# EAGLE design new (EAGLE 9.6.2)
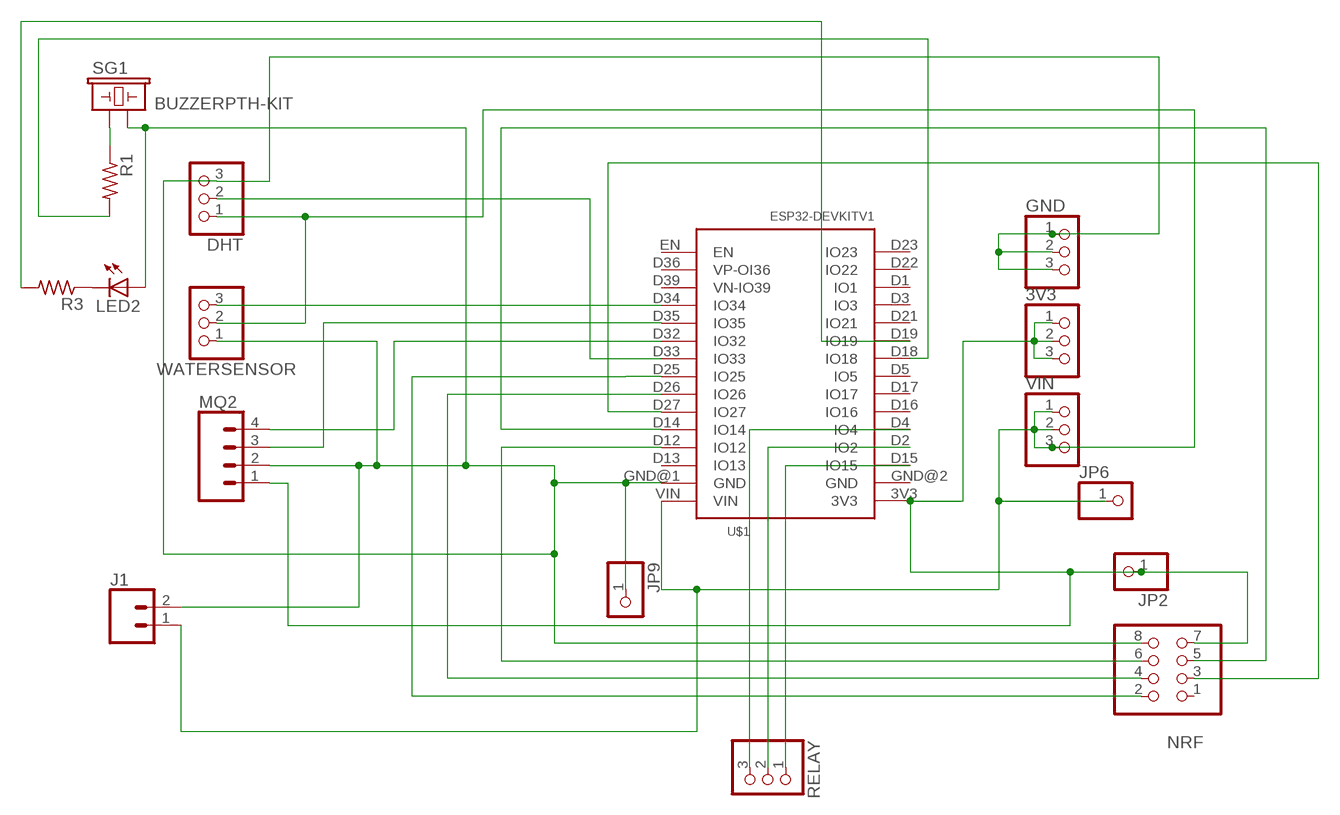
[diagram p0: schematic, sheet 1]

## Parts
3V3  PINHD-1X3  [1X03]
DHT  PINHD-1X3  [1X03]
GND  PINHD-1X3  [1X03]
J1  CONN_02  [1X02]
JP2  PINHD-1X1  [1X01]
JP6  PINHD-1X1  [1X01]
JP9  PINHD-1X1  [1X01]
LED2  LED5MM  [LED5MM]
MQ2  CONN_04PTH  [1X04]
NRF  PINHD-2X4  [2X04]
R1  R-US_0207/7  [0207/7]
R3  R-US_0207/7  [0207/7]
RELAY  PINHD-1X3  [1X03]
SG1  BUZZERPTH-KIT  [BUZZER-12MM-KIT]
U$1  ESP32DEVKITV1  [ESP32-DEVKITV1]
VIN  PINHD-1X3  [1X03]
WATERSENSOR  PINHD-1X3  [1X03]

## Nets
N$1: R1.1 SG1.+
N$2: R1.2 U$1.D18(IO18)
N$3: NRF.4 U$1.D26(IO26)
N$4: NRF.2 U$1.D25(IO25)
N$5: DHT.3 GND.1 GND.2 GND.3 J1.2 JP9.1 LED2.A MQ2.2 NRF.8 SG1.- U$1.GND@1(GND) WATERSENSOR.1
N$6: R3.2 U$1.D19(IO19)
N$7: NRF.3 U$1.D27(IO27)
N$8: LED2.K(C) R3.1
N$9: NRF.6 U$1.D12(IO12)
N$10: NRF.5 U$1.D14(IO14)
N$11: DHT.2 U$1.D33(IO33)
N$12: DHT.1 J1.1 JP6.1 U$1.VIN VIN.1 VIN.2 VIN.3 WATERSENSOR.2
N$13: U$1.D34(IO34) WATERSENSOR.3
N$14: RELAY.3 U$1.D4(IO4)
N$15: RELAY.2 U$1.D2(IO2)
N$16: MQ2.4 U$1.D32(IO32)
N$17: MQ2.3 U$1.D35(IO35)
N$18: RELAY.1 U$1.D15(IO15)
N$19: 3V3.1 3V3.2 3V3.3 JP2.1 MQ2.1 NRF.7 U$1.3V3
Unconnected: NRF.1 U$1.D1(IO1) U$1.D3(IO3) U$1.D5(IO5) U$1.D13(IO13) U$1.D16(IO16) U$1.D17(IO17) U$1.D21(IO21) U$1.D22(IO22) U$1.D23(IO23) U$1.D36(VP-OI36) U$1.D39(VN-IO39) U$1.EN U$1.GND@2(GND)

## Library data of the parts
3V3 DHT GND RELAY VIN WATERSENSOR = adafruit:PINHD-1X3: PIN HEADER
J1 = SparkFun-Connectors:CONN_02: Multi connection point. Often used as Generic Header-pin footprint for 0.1 inch spaced/style header connections On any of the 0.1 inch spaced packages, you can populate with these: Break Away Headers - Straight <https://www.sparkfun.com/products/116> (PRT-00116) Break Away Male Headers - Right Angle <https://www.sparkfun.com/products/553> (PRT-00553) Female Headers <https://www.sparkfun.com/products/115> (PRT-00115) Break Away Headers - Machine Pin <https://www.sparkfun.com/products/117> (PRT-00117) Break Away Female Headers - Swiss Machine Pin <https://www.sparkfun.com/products/743> (PRT-00743) For SCREWTERMINALS and SPRING TERMINALS visit here: Screw Terimnals on SparkFun.com <https://www.sparkfun.com/search/results?term=Screw+Terminals> (5mm/3.5mm/2.54mm spacing) This device is also useful as a general connection point to wire up your design to another part of your project. Our various solder wires solder well into these plated through hole pads. Hook-Up Wire - Assortment (Stranded, 22 AWG) <https://www.sparkfun.com/products/11375> (PRT-11375) Hook-Up Wire - Assortment (Solid Core, 22 AWG) <https://www.sparkfun.com/products/11367> (PRT-11367) View the entire wire category on our website here <https://www.sparkfun.com/categories/141> Special notes: Molex polarized connector foot print use with: PRT-08233 with associated crimp pins and housings. 2.54_SCREWTERM for use with PRT-10571. 3.5mm Screw Terminal footprints for PRT-08084 5mm Screw Terminal footprints for use with PRT-08432
JP2 JP6 JP9 = adafruit:PINHD-1X1: Pin header 1x1 for 0.1" spacing With round pins
LED2 = adafruit:LED: LED OSRAM: - CHIPLED LG R971, LG N971, LY N971, LG Q971, LY Q971, LO R971, LY R971 LH N974, LH R974 LS Q976, LO Q976, LY Q976 LO Q996 - Hyper CHIPLED LW Q18S LB Q993, LB Q99A, LB R99A - SideLED LS A670, LO A670, LY A670, LG A670, LP A670 LB A673, LV A673, LT A673, LW A673 LH A674 LY A675 LS A676, LA A676, LO A676, LY A676, LW A676 LS A679, LY A679, LG A679 - Hyper Micro SIDELED® LS Y876, LA Y876, LO Y876, LY Y876 LT Y87S - SmartLED LW L88C, LW L88S LB L89C, LB L89S, LG L890 LS L89K, LO L89K, LY L89K LS L896, LA L896, LO L896, LY L896 - TOPLED LS T670, LO T670, LY T670, LG T670, LP T670 LSG T670, LSP T670, LSY T670, LOP T670, LYG T670 LG T671, LOG T671, LSG T671 LB T673, LV T673, LT T673, LW T673 LH T674 LS T676, LA T676, LO T676, LY T676, LB T676, LH T676, LSB T676, LW T676 LB T67C, LV T67C, LT T67C, LS T67K, LO T67K, LY T67K, LW E67C LS E67B, LA E67B, LO E67B, LY E67B, LB E67C, LV E67C, LT E67C LW T67C LS T679, LY T679, LG T679 LS T770, LO T770, LY T770, LG T770, LP T770 LB T773, LV T773, LT T773, LW T773 LH T774 LS E675, LA E675, LY E675, LS T675 LS T776, LA T776, LO T776, LY T776, LB T776 LHGB T686 LT T68C, LB T68C - Hyper Mini TOPLED® LB M676 - Mini TOPLED Santana® LG M470 LS M47K, LO M47K, LY M47K Source: http://www.osram.convergy.de/
MQ2 = SparkFun-Connectors:CONN_04: Multi connection point. Often used as Generic Header-pin footprint for 0.1 inch spaced/style header connections On any of the 0.1 inch spaced packages, you can populate with these: Break Away Headers - Straight <https://www.sparkfun.com/products/116> (PRT-00116) Break Away Male Headers - Right Angle <https://www.sparkfun.com/products/553> (PRT-00553) Female Headers <https://www.sparkfun.com/products/115> (PRT-00115) Break Away Headers - Machine Pin <https://www.sparkfun.com/products/117> (PRT-00117) Break Away Female Headers - Swiss Machine Pin <https://www.sparkfun.com/products/743> (PRT-00743) For SCREWTERMINALS and SPRING TERMINALS visit here: Screw Terimnals on SparkFun.com <https://www.sparkfun.com/search/results?term=Screw+Terminals> (5mm/3.5mm/2.54mm spacing) This device is also useful as a general connection point to wire up your design to another part of your project. Our various solder wires solder well into these plated through hole pads. Hook-Up Wire - Assortment (Stranded, 22 AWG) <https://www.sparkfun.com/products/11375> (PRT-11375) Hook-Up Wire - Assortment (Solid Core, 22 AWG) <https://www.sparkfun.com/products/11367> (PRT-11367) View the entire wire category on our website here <https://www.sparkfun.com/categories/141> Special notes: Molex polarized connector foot print use with SKU : PRT-08231 with associated crimp pins and housings. 1MM SMD Version SKU: PRT-10208; PROD_ID: CONN-09696
NRF = adafruit:PINHD-2X4: PIN HEADER
R1 R3 = adafruit:R-US_: RESISTOR, American symbol
SG1 = jonnew:BUZZER: Buzzer 12mm Spark Fun Electronics SKU : Comp-Buzzer; PROD_ID: COMP-08253
U$1 = ESP32-DEVKITV1 (1):ESP32DEVKITV1

## Board
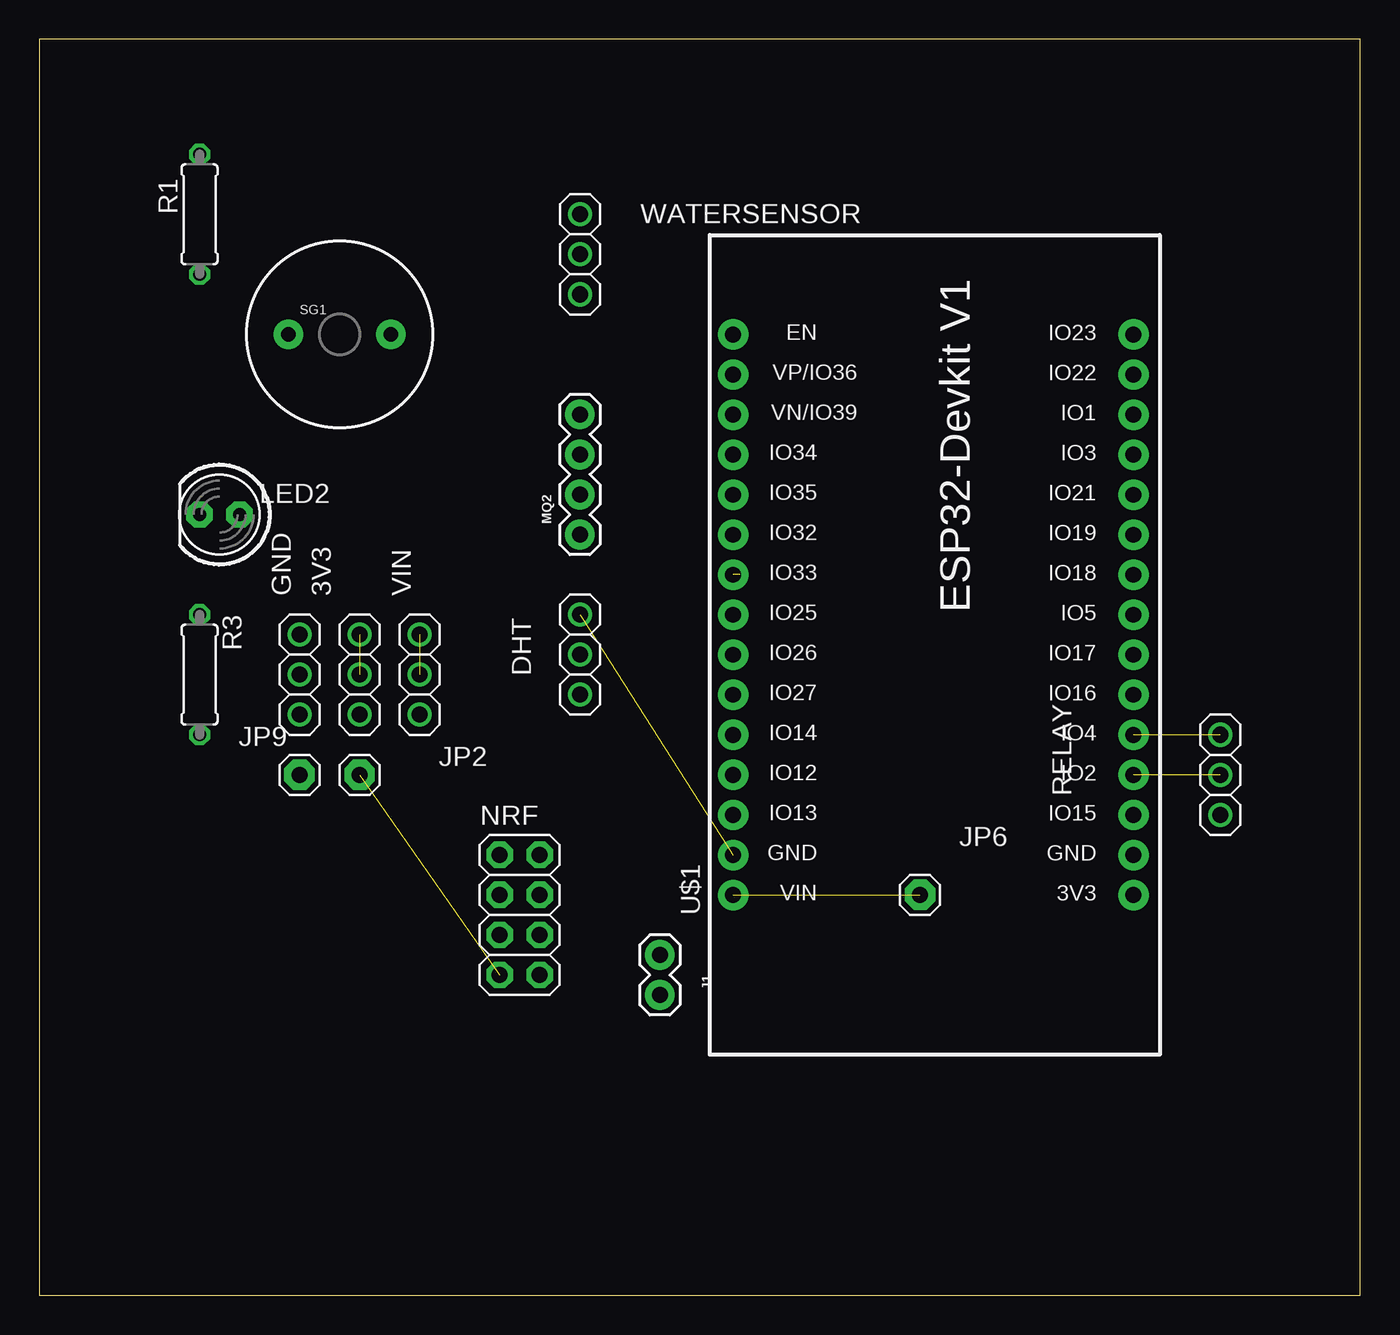
[diagram p1: board, top side]
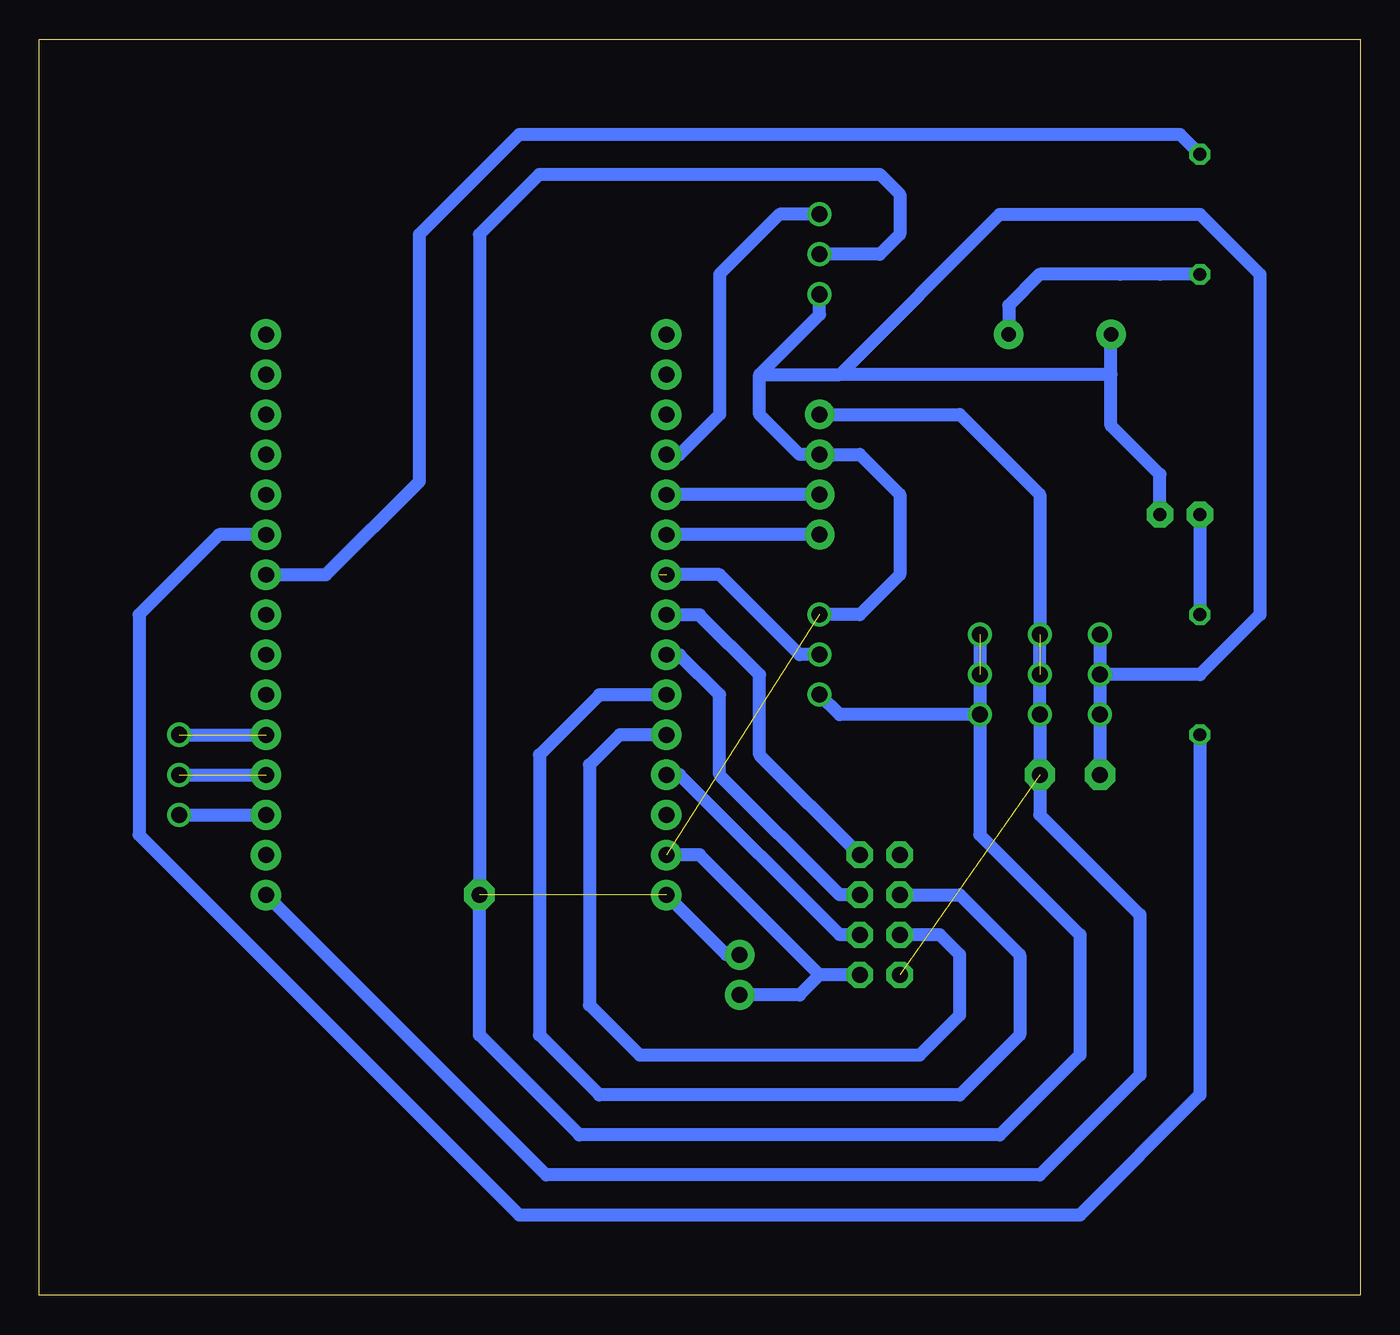
[diagram p2: board, bottom side, seen from below]

Size 83.8 x 79.68 mm. Coordinates in mm from the lower left corner, seen from the top.
Outline: 0,0 83.8,0 83.8,79.68 0,79.68 0,0
Copper layers (1*16): Top 0.035mm / dielectric 1.5mm / Bottom 0.035mm
Design rules "default": minimum track width 6mil, minimum drill 0.35mm, track to track 6mil, track to pad 6mil, pad to pad 6mil, via to via 6mil, smd to smd 6mil, copper to edge 40mil, drill to drill 6mil, minimum pad ring 10mil, minimum via ring 8mil, stop-mask expansion 4mil, vias tented up to drill 0mil, thermal gap 10mil

### Footprints (pad centres in the part's own frame; a part is rotated, then mirrored left to right if it is on the bottom)
1X03 = drill 1.016: 1 -2.54,0; 2 0,0; 3 2.54,0
1X02 = drill 1.016 pad 1.88: 1 0,0; 2 2.54,0
1X01 = drill 1.016 pad 1.93 octagon: 1 0,0
LED5MM = drill 0.813 pad 1.676 octagon: A -1.27,0; K 1.27,0
1X04 = drill 1.016 pad 1.88: 1 0,0; 2 2.54,0; 3 5.08,0; 4 7.62,0
2X04 = drill 1.016 pad 1.676 octagon: 1 -3.81,-1.27; 2 -3.81,1.27; 3 -1.27,-1.27; 4 -1.27,1.27; 5 1.27,-1.27; 6 1.27,1.27; 7 3.81,-1.27; 8 3.81,1.27
0207/7 = drill 0.813 octagon: 1 -3.81,0; 2 3.81,0
BUZZER-12MM-KIT = drill 0.9 pad 1.88: + 3.25,0; - -3.25,0
ESP32-DEVKITV1 = drill 1 pad 1.93: 3V3 -16.52,-12.27; D1 13.96,-12.27; D2 -8.9,-12.27; D3 11.42,-12.27; D4 -6.36,-12.27; D5 1.26,-12.27; D12 -8.9,13.135; D13 -11.44,13.135; D14 -6.36,13.135; D15 -11.44,-12.27; D16 -3.82,-12.27; D17 -1.28,-12.27; D18 3.8,-12.27; D19 6.34,-12.27; D21 8.88,-12.27; D22 16.5,-12.27; D23 19.04,-12.27; D25 1.26,13.135; D26 -1.28,13.135; D27 -3.82,13.135; D32 6.34,13.135; D33 3.8,13.135; D34 11.42,13.135; D35 8.88,13.135; D36 16.5,13.135; D39 13.96,13.135; EN 19.04,13.135; GND@1 -13.98,13.135; GND@2 -13.98,-12.27; VIN -16.52,13.135

### Placement (x,y rotation side)
3V3  20.32,39.37 90 top
DHT  34.29,40.64 90 top
GND  16.51,39.37 90 top
J1  39.37,21.59 270 top
JP2  20.32,33.02 0 top
JP6  55.88,25.4 0 top
JP9  16.51,33.02 0 top
LED2  11.43,49.53 180 top
MQ2  34.29,55.88 270 top
NRF  30.48,24.13 270 top
R1  10.16,68.58 90 top
R3  10.16,39.37 270 top
RELAY  74.93,33.02 90 top
SG1  19.05,60.96 0 top
U$1  57.15,41.91 90 top
VIN  24.13,39.37 90 top
WATERSENSOR  34.29,66.04 90 top

### Tracks (layer width: path | path; a pad name or v marks a point on that pad's centre or on a via)
N$1
  Bottom 0.813: SG1.+ 22.3,62.79 20.32,64.77 15.24,64.77 12.7,64.77 R1.1
N$2
  Bottom 0.813: U$1.D18 65.61,45.71 59.69,51.63 59.69,67.31 53.34,73.66 11.43,73.66 R1.2
N$3
  Bottom 0.813: NRF.4 33.02,25.4 40.64,33.02 40.64,38.1 43.17,40.63 U$1.D26
N$4
  Bottom 0.813: NRF.2 38.1,34.29 38.1,39.37 41.9,43.17 U$1.D25
N$5  (1 unrouted)
  Bottom 0.813: GND.3 GND.2 | GND.2 GND.1 JP9.1 | NRF.8 34.29,20.32 | 34.29,20.32 41.91,27.94 44,27.94 U$1.GND@1 | 38.1,58.42 38.1,55.88 35.56,53.34 MQ2.2 31.75,53.34 29.21,50.8 29.21,45.72 31.75,43.18 DHT.3 | 38.1,58.42 34.29,62.23 WATERSENSOR.1 | LED2.A 12.7,52.07 15.8,55.17 15.8,58.42 | 15.8,58.42 SG1.- | 15.8,58.42 33.02,58.42 | 38.1,58.42 33.02,58.42 | 33.02,58.42 22.86,68.58 10.16,68.58 6.35,64.77 6.35,43.18 10.16,39.37 GND.2 | 34.29,20.32 35.56,19.05 J1.2
N$6
  Bottom 0.813: R3.2 10.16,12.7 17.78,5.08 53.34,5.08 77.47,29.21 77.47,43.18 72.4,48.25 U$1.D19
N$7
  Bottom 0.813: NRF.3 25.4,25.4 21.59,21.59 21.59,16.51 25.4,12.7 48.26,12.7 52.07,16.51 52.07,34.29 48.27,38.09 U$1.D27
N$8
  Bottom 0.813: LED2.K R3.1
N$9
  Bottom 0.813: NRF.6 33.02,22.86 43.18,33.02 44,33.02 U$1.D12
N$10
  Bottom 0.813: U$1.D14 46.98,35.55 46.99,35.56 48.89,33.66 48.89,18.41 45.72,15.24 27.94,15.24 25.4,17.78 25.4,21.59 26.67,22.86 NRF.5
N$11  (1 unrouted)
  Bottom 0.813: DHT.2 35.56,40.64 40.64,45.72 44.45,45.72
N$12  (2 unrouted)
  Bottom 0.813: VIN.3 VIN.1 | VIN.1 24.13,29.21 17.78,22.86 17.78,15.24 22.86,10.16 49.53,10.16 55.88,16.51 JP6.1 55.88,67.31 52.07,71.12 30.48,71.12 29.21,69.85 29.21,67.31 30.48,66.04 WATERSENSOR.2 | VIN.1 33.02,36.83 DHT.1 | U$1.VIN 40.22,21.59 J1.1
N$13
  Bottom 0.813: WATERSENSOR.3 36.83,68.58 40.64,64.77 40.64,55.88 43.19,53.33 U$1.D34
N$14  (1 unrouted)
  Bottom 0.813: RELAY.3 U$1.D4
N$15  (1 unrouted)
  Bottom 0.813: RELAY.2 U$1.D2
N$16
  Bottom 0.813: MQ2.4 44,48.26 U$1.D32
N$17
  Bottom 0.813: MQ2.3 44,50.8 U$1.D35
N$18
  Bottom 0.813: RELAY.1 U$1.D15
N$19  (2 unrouted)
  Bottom 0.813: U$1.3V3 51.65,7.62 20.32,7.62 13.97,13.97 13.97,24.13 20.32,30.48 JP2.1 3V3.1 3V3.3 20.32,50.8 25.4,55.88 MQ2.1